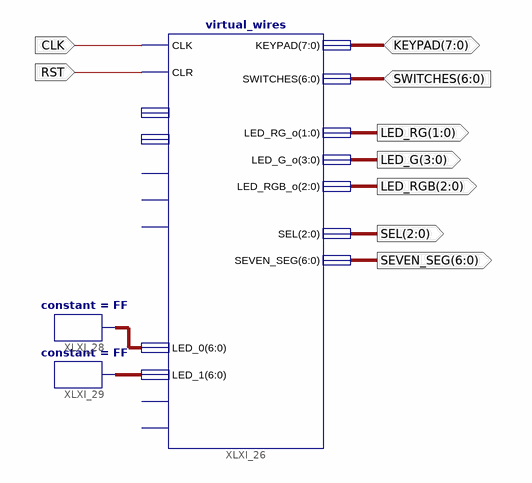
[diagram p0: schematic sheet 1]
// Xilinx ISE schematic top_level.sch (zynq) as structural Verilog: 3 symbols, 9 ports
module top_level (
  input  [6:0] SWITCHES,
  input  CLK,
  input  RST,
  inout  [7:0] KEYPAD,
  output [1:0] LED_RG,
  output [3:0] LED_G,
  output [2:0] LED_RGB,
  output [2:0] SEL,
  output [6:0] SEVEN_SEG
);

  wire [6:0] XLXN_149, XLXN_150;

  virtual_wires XLXI_26 (
    .CLK(CLK), .CLR(RST), .SWITCHES(SWITCHES), .KEYPAD(KEYPAD), .LED_RG_o(LED_RG), .LED_G_o(LED_G),
    .LED_RGB_o(LED_RGB), .SEL(SEL), .SEVEN_SEG(SEVEN_SEG), .LED_0(XLXN_150), .LED_1(XLXN_149));  // open: RED, GREEN, DIGIT_0, DIGIT_1, SW_0, SW_1, SW_2
  constant #(.CValue("FF")) XLXI_29 (.O(XLXN_149));
  constant #(.CValue("FF")) XLXI_28 (.O(XLXN_150));
endmodule
